# EAGLE design toshiba_board (EAGLE 7.1.0)
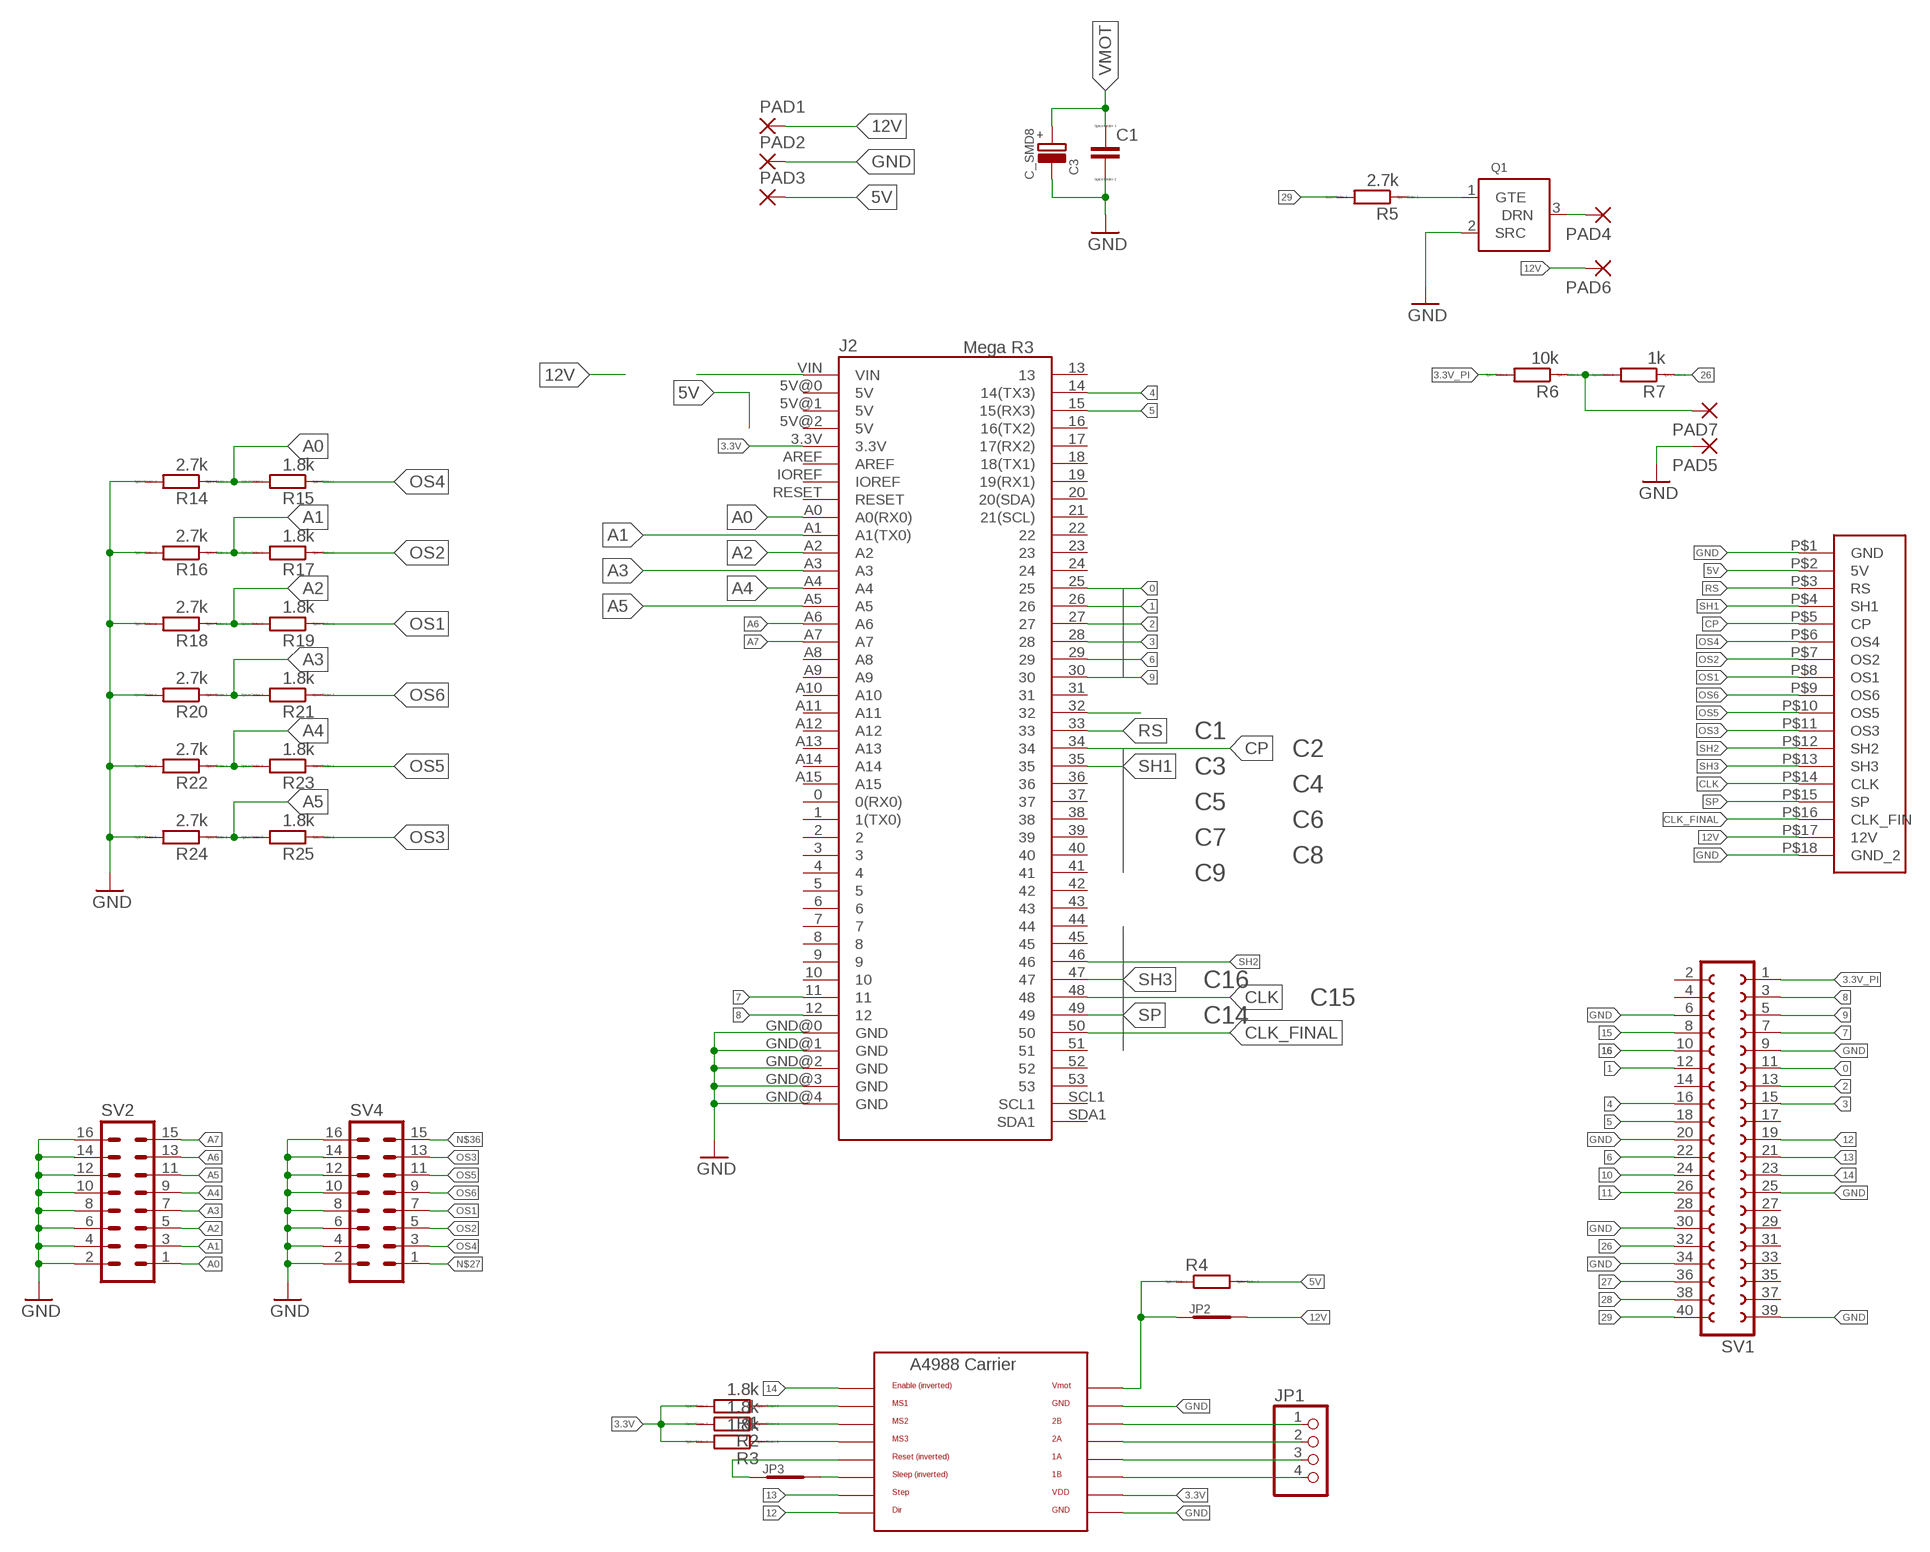
[diagram p0: schematic, sheet 1]

## Parts
C1  C-EUC0805  [C0805]
C3  C_SMD8  [C-SMD-8MM]
J2  Mega R3  ARDUINO-MEGAFULL  [ARDUINO_MEGA]
JP1  PINHD-1X4  [1X04]
JP2  SHORT0805  [0805_SHORT]
JP3  SHORT0805  [0805_SHORT]
PAD1  SMD2  [SMD1,27-2,54]
PAD2  SMD2  [SMD1,27-2,54]
PAD3  SMD2  [SMD1,27-2,54]
PAD4  SMD2  [SMD1,27-2,54]
PAD5  SMD2  [SMD1,27-2,54]
PAD6  SMD2  [SMD1,27-2,54]
PAD7  SMD2  [SMD1,27-2,54]
Q1  BSS138  [SOT23]
R1  1.8k  R-EU_R0603  [R0603]
R2  1.8k  R-EU_R0603  [R0603]
R3  1.8k  R-EU_R0603  [R0603]
R4  R-EU_R0805  [R0805]
R5  2.7k  R-EU_R0603  [R0603]
R6  10k  R-EU_R0603  [R0603]
R7  1k  R-EU_R0603  [R0603]
R14  2.7k  R-EU_R0603  [R0603]
R15  1.8k  R-EU_R0603  [R0603]
R16  2.7k  R-EU_R0603  [R0603]
R17  1.8k  R-EU_R0603  [R0603]
R18  2.7k  R-EU_R0603  [R0603]
R19  1.8k  R-EU_R0603  [R0603]
R20  2.7k  R-EU_R0603  [R0603]
R21  1.8k  R-EU_R0603  [R0603]
R22  2.7k  R-EU_R0603  [R0603]
R23  1.8k  R-EU_R0603  [R0603]
R24  2.7k  R-EU_R0603  [R0603]
R25  1.8k  R-EU_R0603  [R0603]
SV1  FE20-2  [FE20-2]
SV2  MA08-2  [MA08-2]
SV4  MA08-2  [MA08-2]
U$1  PIN_18  [PAD_18]
U$2  POLOLU_A4983CARRIER  [A4988BREAKOUT]

## Nets
0: J2.25 SV1.11
1: J2.26 SV1.12
2: J2.27 SV1.13
3: J2.28 SV1.15
3.3V: J2.3.3V R1.2 R2.2 R3.2 U$2.VDD
3.3V_PI: R6.2 SV1.1
4: J2.14(14(TX3)) SV1.16
5: J2.15(15(RX3)) SV1.18
5V: PAD3.1(P) R4.2 U$1.P$2(5V)
6: J2.29 SV1.22
7: J2.11 SV1.7
8: J2.12 SV1.3
9: J2.30 SV1.5
10: SV1.24
11: SV1.26
12: SV1.19 U$2.DIR
12V: JP2.P$2 PAD1.1(P) PAD6.1(P) U$1.P$17(12V)
13: SV1.21 U$2.STEP
14: SV1.23 U$2.EN
15: SV1.8
16: SV1.10
26: R7.1 SV1.32
27: SV1.36
28: SV1.38
29: R5.2 SV1.40
A0: J2.A0(A0(RX0)) R14.1 R15.2 SV2.1
A1: J2.A1(A1(TX0)) R16.1 R17.2 SV2.3
A2: J2.A2 R18.1 R19.2 SV2.5
A3: J2.A3 R20.1 R21.2 SV2.7
A4: J2.A4 R22.1 R23.2 SV2.9
A5: J2.A5 R24.1 R25.2 SV2.11
A6: J2.A6 SV2.13
A7: J2.A7 SV2.15
CLK: J2.48 U$1.P$14(CLK)
CLK_FINAL: J2.50 U$1.P$16(CLK_FIN)
CP: J2.34 U$1.P$5(CP)
GND: C1.2 C3.- J2.GND@0(GND) J2.GND@1(GND) J2.GND@2(GND) J2.GND@3(GND) J2.GND@4(GND) PAD2.1(P) PAD5.1(P) Q1.2(SRC) R14.2 R16.2 R18.2 R20.2 R22.2 R24.2 SV1.6 SV1.9 SV1.20 SV1.25 SV1.30 SV1.34 SV1.39 SV2.2 SV2.4 SV2.6 SV2.8 SV2.10 SV2.12 SV2.14 SV2.16 SV4.2 SV4.4 SV4.6 SV4.8 SV4.10 SV4.12 SV4.14 SV4.16 U$1.P$1(GND) U$1.P$18(GND_2) U$2.GND U$2.GND@0(GND)
N$2: Q1.1(GTE) R5.1
N$3: JP1.1 U$2.2B
N$4: JP1.2 U$2.2A
N$5: JP1.3 U$2.1A
N$6: PAD7.1(P) R6.1 R7.2
N$7: PAD4.1(P) Q1.3(DRN)
N$8: J2.VIN
N$13: JP1.4 U$2.1B
N$14: R1.1 U$2.MS1
N$15: R2.1 U$2.MS2
N$16: JP3.P$2 U$2.SLP(SLEEP)
N$17: R3.1 U$2.MS3
N$18: J2.32
N$19: JP3.P$1 U$2.RST
N$27: SV4.1
N$36: SV4.15
OS1: R19.1 SV4.7 U$1.P$8(OS1)
OS2: R17.1 SV4.5 U$1.P$7(OS2)
OS3: R25.1 SV4.13 U$1.P$11(OS3)
OS4: R15.1 SV4.3 U$1.P$6(OS4)
OS5: R23.1 SV4.11 U$1.P$10(OS5)
OS6: R21.1 SV4.9 U$1.P$9(OS6)
RS: J2.33 U$1.P$3(RS)
SH1: J2.35 U$1.P$4(SH1)
SH2: J2.46 U$1.P$12(SH2)
SH3: J2.47 U$1.P$13(SH3)
SP: J2.49 U$1.P$15(SP)
VMOT: C1.1 C3.+ JP2.P$1 R4.1 U$2.VMOT
Unconnected: J2.0(0(RX0)) J2.1(1(TX0)) J2.2 J2.3 J2.4 J2.5 J2.5V@0(5V) J2.5V@1(5V) J2.5V@2(5V) J2.6 J2.7 J2.8 J2.9 J2.10 J2.13 J2.16(16(TX2)) J2.17(17(RX2)) J2.18(18(TX1)) J2.19(19(RX1)) J2.20(20(SDA)) J2.21(21(SCL)) J2.22 J2.23 J2.24 J2.31 J2.36 J2.37 J2.38 J2.39 J2.40 J2.41 J2.42 J2.43 J2.44 J2.45 J2.51 J2.52 J2.53 J2.A8 J2.A9 J2.A10 J2.A11 J2.A12 J2.A13 J2.A14 J2.A15 J2.AREF J2.IOREF J2.RESET J2.SCL1 J2.SDA1 SV1.2 SV1.4 SV1.14 SV1.17 SV1.27 SV1.28 SV1.29 SV1.31 SV1.33 SV1.35 SV1.37

## Notes on the sheet
- C1
- C2
- C3
- C4
- C5
- C6
- C7
- C8
- C9
- C16
- C15
- C14

## Library data of the parts
C1 = resistor:C-EU: CAPACITOR, European symbol; SPICEPREFIX: C
C3 = diverses:C_SMD
J2 = zortness:ARDUINO-MEGA: Arduino MegaR3 board footprint. Also works for Due.
JP1 = RepRapjr:PINHD-1X4: PIN HEADER
JP2 JP3 = Diverse:SHORT
PAD1-PAD7 = wirepad:SMD2: SMD PAD
Q1 = zortness:BSS138
R1-R7 R14-R25 = resistor:R-EU_: RESISTOR, European symbol; SPICEPREFIX: R
SV1 = con-lsta:FE20-2: FEMALE HEADER; OC_FARNELL: unknown; OC_NEWARK: unknown
SV2 SV4 = con-lstb:MA08-2: PIN HEADER; OC_FARNELL: unknown; OC_NEWARK: unknown
U$1 = Diverse:PIN_18
U$2 = RepRapjr:POLOLU_A4983CARRIER

## Net classes
1 pwr: width 0.305 mm
2 raw: width 0.305 mm

## Board
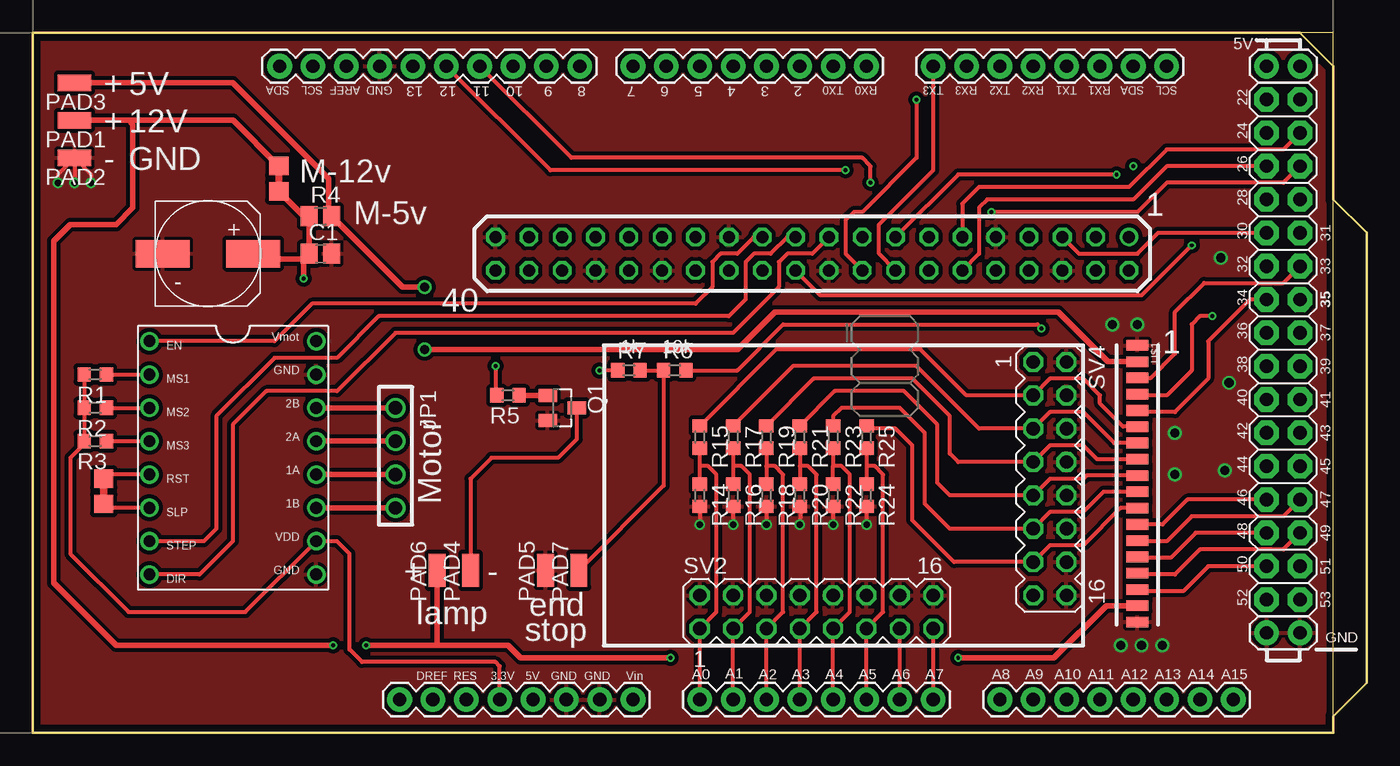
[diagram p1: board, top side]
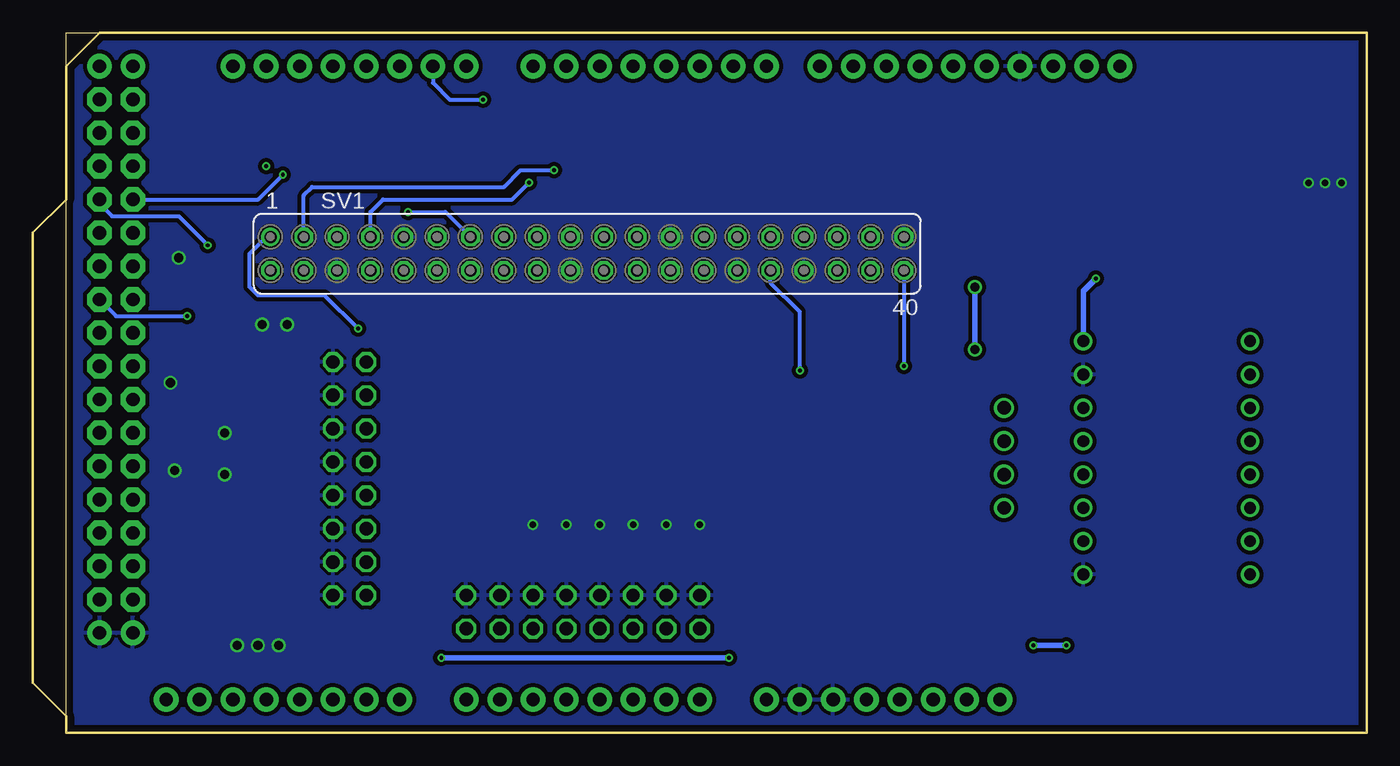
[diagram p2: board, bottom side, seen from below]

Size 99.04 x 53.33 mm. Coordinates in mm from the lower left corner, seen from the top.
Outline: 0,0 99.04,0 99.04,53.33 0,53.33 0,0
Copper layers (1*16): Top 0.035mm / dielectric 1.5mm / Bottom 0.035mm
Design rules "ShenZhen2U EagleRules": minimum track width 7mil, minimum drill 12mil, track to track 7mil, track to pad 7mil, pad to pad 7mil, via to via 7mil, smd to smd 0mil, copper to edge 20mil, drill to drill 10mil, minimum pad ring 10mil, minimum via ring 6mil, stop-mask expansion 2mil, vias tented up to drill 25mil, thermal gap 10mil

### Footprints (pad centres in the part's own frame; a part is rotated, then mirrored left to right if it is on the bottom)
C0805 = smd 1.3 x 1.5: 1 -0.85,0; 2 0.85,0
C-SMD-8MM = smd 4.1 x 2.1: + -3.45,0; - 3.45,0
ARDUINO_MEGA = drill 1.016 pad 1.88: 0 63.5,50.8; 1 60.96,50.8; 2 58.42,50.8; 3 55.88,50.8; 3.3V 35.56,2.54; 4 53.34,50.8; 5 50.8,50.8; 5V@0 38.1,2.54; 5V@1 93.98,50.8; 5V@2 96.52,50.8; 6 48.26,50.8; 7 45.72,50.8; 8 41.656,50.8; 9 39.116,50.8; 10 36.576,50.8; 11 34.036,50.8; 12 31.496,50.8; 13 28.956,50.8; 14 68.58,50.8; 15 71.12,50.8; 16 73.66,50.8; 17 76.2,50.8; 18 78.74,50.8; 19 81.28,50.8; 20 83.82,50.8; 21 86.36,50.8; A0 50.8,2.54; A1 53.34,2.54; A2 55.88,2.54; A3 58.42,2.54; A4 60.96,2.54; A5 63.5,2.54; A6 66.04,2.54; A7 68.58,2.54; A8 73.66,2.54; A9 76.2,2.54; A10 78.74,2.54; A11 81.28,2.54; A12 83.82,2.54; A13 86.36,2.54; A14 88.9,2.54; A15 91.44,2.54; AREF 23.876,50.8; EMPTY 27.94,2.54; GND@0 40.64,2.54; GND@1 43.18,2.54; GND@2 93.98,7.62; GND@3 96.52,7.62; GND@4 26.416,50.8; IOREF 30.48,2.54; RESET 33.02,2.54; SCL1 21.336,50.8; SDA1 18.796,50.8; VIN 45.72,2.54 | drill 1.016 pad 1.88 octagon: 22 93.98,48.26; 23 96.52,48.26; 24 93.98,45.72; 25 96.52,45.72; 26 93.98,43.18; 27 96.52,43.18; 28 93.98,40.64; 29 96.52,40.64; 30 93.98,38.1; 31 96.52,38.1; 32 93.98,35.56; 33 96.52,35.56; 34 93.98,33.02; 35 96.52,33.02; 36 93.98,30.48; 37 96.52,30.48; 38 93.98,27.94; 39 96.52,27.94; 40 93.98,25.4; 41 96.52,25.4; 42 93.98,22.86; 43 96.52,22.86; 44 93.98,20.32; 45 96.52,20.32; 46 93.98,17.78; 47 96.52,17.78; 48 93.98,15.24; 49 96.52,15.24; 50 93.98,12.7; 51 96.52,12.7; 52 93.98,10.16; 53 96.52,10.16
1X04 = drill 1.016: 1 -2.54,0; 2 0,0; 3 2.54,0; 4 5.08,0
0805_SHORT = smd 1.397 x 1.473: P$1 -0.965,0; P$2 0.965,0
SMD1,27-2,54 = smd 1.27 x 2.54: 1 0,0
SOT23 = smd 1 x 1.4: 1 -0.95,-1.1; 2 0.95,-1.1; 3 0,1.1
R0603 = smd 1 x 1.1: 1 -0.85,0; 2 0.85,0
R0805 = smd 1.3 x 1.5: 1 -0.85,0; 2 0.85,0
FE20-2 = drill 0.914: 1 -24.13,1.27 | drill 0.914 octagon: 2 -24.13,-1.27; 3 -21.59,1.27; 4 -21.59,-1.27; 5 -19.05,1.27; 6 -19.05,-1.27; 7 -16.51,1.27; 8 -16.51,-1.27; 9 -13.97,1.27; 10 -13.97,-1.27; 11 -11.43,1.27; 12 -11.43,-1.27; 13 -8.89,1.27; 14 -8.89,-1.27; 15 -6.35,1.27; 16 -6.35,-1.27; 17 -3.81,1.27; 18 -3.81,-1.27; 19 -1.27,1.27; 20 -1.27,-1.27; 21 1.27,1.27; 22 1.27,-1.27; 23 3.81,1.27; 24 3.81,-1.27; 25 6.35,1.27; 26 6.35,-1.27; 27 8.89,1.27; 28 8.89,-1.27; 29 11.43,1.27; 30 11.43,-1.27; 31 13.97,1.27; 32 13.97,-1.27; 33 16.51,1.27; 34 16.51,-1.27; 35 19.05,1.27; 36 19.05,-1.27; 37 21.59,1.27; 38 21.59,-1.27; 39 24.13,1.27; 40 24.13,-1.27
MA08-2 = drill 1.016 octagon: 1 -8.89,-1.27; 2 -8.89,1.27; 3 -6.35,-1.27; 4 -6.35,1.27; 5 -3.81,-1.27; 6 -3.81,1.27; 7 -1.27,-1.27; 8 -1.27,1.27; 9 1.27,-1.27; 10 1.27,1.27; 11 3.81,-1.27; 12 3.81,1.27; 13 6.35,-1.27; 14 6.35,1.27; 15 8.89,-1.27; 16 8.89,1.27
PAD_18 = smd 0.813 x 1.676: P$1 0,0; P$2 1.24,0; P$3 2.48,0; P$4 3.72,0; P$5 4.96,0; P$6 6.2,0; P$7 7.44,0; P$8 8.68,0; P$9 9.92,0; P$10 11.16,0; P$11 12.4,0; P$12 13.64,0; P$13 14.88,0; P$14 16.12,0; P$15 17.36,0; P$16 18.6,0; P$17 19.84,0; P$18 21.08,0
A4988BREAKOUT = drill 0.9: 1A 8.89,1.27; 1B 11.43,1.27; 2A 6.35,1.27; 2B 3.81,1.27; DIR 16.51,-11.43; EN -1.27,-11.43; GND 16.51,1.27; GND@0 1.27,1.27; MS1 1.27,-11.43; MS2 3.81,-11.43; MS3 6.35,-11.43; RST 8.89,-11.43; SLP 11.43,-11.43; STEP 13.97,-11.43; VDD 13.97,1.27; VMOT -1.27,1.27

### Placement (x,y rotation side)
C1  21.91,36.51 0 top
C3  13.34,36.51 180 top
J2  0,0 0 top
JP1  27.62,22.23 270 top
JP2  18.73,42.23 90 top
JP3  5.4,18.41 270 top
PAD1  3.17,46.67 90 top
PAD2  3.17,43.81 90 top
PAD3  3.17,49.53 90 top
PAD4  33.34,12.38 0 top
PAD5  39.05,12.38 0 top
PAD6  30.8,12.38 0 top
PAD7  41.59,12.38 0 top
Q1  40.32,24.77 270 top
R1  4.76,27.3 180 top
R2  4.76,24.77 180 top
R3  4.76,22.23 180 top
R4  21.91,39.37 0 top
R5  36.2,25.72 180 top
R6  48.9,27.62 0 top
R7  45.4,27.62 0 top
R14  50.8,18.1 270 top
R15  50.8,22.54 270 top
R16  53.34,18.1 270 top
R17  53.34,22.54 270 top
R18  55.88,18.1 270 top
R19  55.88,22.54 270 top
R20  58.42,18.1 270 top
R21  58.42,22.54 270 top
R22  60.96,18.1 270 top
R23  60.96,22.54 270 top
R24  63.5,18.1 270 top
R25  63.5,22.54 270 top
SV1  59.37,36.51 0 bottom
SV2  59.69,9.21 0 top
SV4  77.47,19.37 270 top
U$1  84.14,29.53 270 top
U$2  20.32,28.57 270 top

### Tracks (layer width: path | path; a pad name or v marks a point on that pad's centre or on a via)
0
  Top 0.305: J2.25 95.25,44.45 86.36,44.45 83.5,41.59 72.07,41.59 70.8,40.32 SV1.11
1
  Top 0.305: J2.26 86.36,43.18 83.82,40.64 72.71,40.64 72.07,40.01 72.07,36.51 SV1.12
2  (via drill 0.3)
  Top 0.305: J2.27 95.25,41.91 86.36,41.91 84.14,39.69 v73.03,39.69
  Bottom 0.305: v73.03,39.69 70.17,39.69 SV1.13
3  (via drill 0.3)
  Top 0.305: v82.55,42.55 70.48,42.55 SV1.15
  Bottom 0.305: J2.28 84.45,40.64 v82.55,42.55
3.3V
  Top 0.305: R1.2 R2.2 R3.2 3.91,22.01 2.86,20.95 2.86,13.65 7.3,9.21 16.19,9.21 U$2.VDD 23.18,14.61 24.13,13.65 24.13,6.35 25.08,5.4 35.24,5.4 35.56,5.08 J2.3.3V
3.3V_PI  (via drill 0.3)
  Top 0.305: R6.2 53.66,27.62 57.15,31.11 76.52,31.11 v76.83,30.8
  Bottom 0.305: v76.83,30.8 79.38,33.34 84.45,33.34 85.09,33.97 85.09,36.51 83.82,37.78 SV1.1
4
  Top 0.305: SV1.16 64.45,36.51 64.45,38.73 68.58,42.86 J2.14
5  (via drill 0.3)
  Top 0.305: v67.31,48.26 67.31,43.81 63.18,39.69 62.55,39.69 61.91,39.05 61.91,36.51 SV1.18
  Bottom 0.305: J2.15 71.12,49.53 69.85,48.26 v67.31,48.26
5V  (via drill 0.7)
  Top 0.406: U$1.P$2 81.89,28.29 78.11,32.07 56.52,32.07 53.66,29.21 v29.84,29.21 | PAD3.1 15.24,49.53 22.54,42.23 22.54,39.59 R4.2 28.16,33.97 v29.84,33.97
  Bottom 0.406: v29.84,29.21 v29.84,33.97
6  (via drill 0.3)
  Top 0.305: v88.27,37.15 84.45,33.34 60.01,33.34 SV1.22
  Bottom 0.305: J2.29 96.52,40.32 95.57,39.37 90.49,39.37 v88.27,37.15
7  (via drill 0.3)
  Top 0.305: v63.82,41.91 63.82,43.18 63.18,43.81 41.02,43.81 J2.11
  Bottom 0.305: SV1.7 75.88,39.69 74.93,40.64 65.09,40.64 v63.82,41.91
8  (via drill 0.3)
  Top 0.305: v61.91,42.86 39.43,42.86 J2.12
  Bottom 0.305: SV1.3 80.96,40.96 80.33,41.59 65.72,41.59 64.45,42.86 v61.91,42.86
9
  Top 0.305: SV1.5 79.69,36.51 84.14,36.51 85.72,38.1 J2.30
12
  Top 0.305: SV1.19 59.37,36.51 57.47,36.51 56.83,35.88 56.83,33.97 53.34,30.48 27.62,30.48 23.18,26.04 17.78,26.04 15.24,23.5 15.24,14.61 12.7,12.06 U$2.DIR
12V  (via drill 0.3)
  Top 0.406: PAD1.1 7.3,46.67 | 7.3,46.67 15.25,46.67 JP2.P$2 | U$1.P$17 81.76,9.69 77.79,5.71 v70.48,5.71 | v48.58,5.71 37.15,5.71 36.2,6.67 30.8,6.67 | 30.8,6.67 v25.4,6.67 | v22.86,6.67 6.35,6.67 1.59,11.43 1.59,37.47 2.86,38.73 6.35,38.73 7.62,40.01 7.62,46.35 7.3,46.67 | PAD6.1 30.8,6.67
  Bottom 0.406: v70.48,5.71 v48.58,5.71 | v25.4,6.67 v22.86,6.67
13
  Top 0.305: U$2.STEP 13.02,14.61 13.97,15.56 13.97,24.13 18.41,28.57 23.18,28.57 26.35,31.75 53.02,31.75 54.29,33.02 54.29,35.88 54.93,36.51 56.2,36.51 57.47,37.78 SV1.21
14
  Top 0.305: U$2.EN 18.41,29.84 21.27,32.7 50.48,32.7 51.75,33.97 51.75,35.88 52.39,36.51 53.66,36.51 54.93,37.78 SV1.23
26  (via drill 0.3)
  Top 0.305: R7.1 v43.18,27.62
  Bottom 0.305: v43.18,27.62 43.18,32.07 45.4,34.29 SV1.32
29  (via drill 0.3)
  Top 0.305: v35.24,27.94 35.24,25.82 R5.2
  Bottom 0.305: SV1.40 v35.24,27.94
A0
  Top 0.305: J2.A0 SV2.1 52.07,9.21 52.07,19.68 51.44,20.32 50.8,20.32 | R14.1 50.8,20.32 | 50.8,20.32 R15.2
A1
  Top 0.305: J2.A1 SV2.3 54.61,9.21 54.61,19.68 53.98,20.32 53.34,20.32 | R17.2 53.34,20.32 | 53.34,20.32 R16.1
A2
  Top 0.305: J2.A2 SV2.5 57.15,9.21 57.15,19.68 56.52,20.32 55.88,20.32 | 55.88,20.32 R18.1 | R19.2 55.88,20.32
A3
  Top 0.305: J2.A3 SV2.7 59.69,9.21 59.69,19.68 59.05,20.32 58.42,20.32 | R21.2 58.32,21.69 58.1,21.91 58.42,21.91 58.42,20.32 | 58.42,20.32 R20.1
A4
  Top 0.305: J2.A4 SV2.9 62.23,9.21 62.23,19.68 61.59,20.32 60.96,20.32 | R23.2 60.96,20.32 | R22.1 60.96,20.32
A5
  Top 0.305: J2.A5 SV2.11 64.77,9.21 64.77,19.68 64.14,20.32 63.5,20.32 | 63.5,20.32 R24.1 | R25.2 63.5,20.32
A6
  Top 0.305: J2.A6 SV2.13
A7
  Top 0.305: J2.A7 SV2.15
CLK
  Top 0.305: J2.48 88.58,15.24 86.68,13.34 84.21,13.34 U$1.P$14
CLK_FINAL
  Top 0.305: J2.50 89.53,12.7 87.63,10.79 84.27,10.79 U$1.P$16
CP
  Top 0.305: J2.34 92.71,33.02 89.53,29.84 89.53,26.99 87,24.45 84.26,24.45 U$1.P$5
GND  (via drill 0.5, 0.7)
  Top 0.305: R16.2 v53.34,15.88 | R22.2 v60.96,15.88 | R14.2 v50.8,15.88 | R24.2 v63.5,15.88 | R18.2 v55.88,15.88 | v58.42,15.88 58.63,17.46 R20.2 | PAD2.1 v3.17,41.91 | PAD2.1 4.45,42.55 v4.45,41.91 | PAD2.1 1.91,42.55 v1.91,41.91
  other vias: 82.23,31.11 84.14,31.11 82.87,6.67 84.45,6.67 86.04,6.67 87,22.86 87,19.68 90.81,20 91.12,26.67 90.49,36.2
  pour Bottom (isolate 0.305): 0,53.34 99.06,53.34 99.06,0 0,0
  pour Top (isolate 0.305): 0,53.34 99.06,53.34 99.06,0 0,0
N$1  (via drill 0.3)
  other vias: 83.82,43.18
N$2
  Top 0.406: Q1.1 R5.1
N$3
  Top 0.406: U$2.2B JP1.1
N$4
  Top 0.406: U$2.2A JP1.2
N$5
  Top 0.406: U$2.1A JP1.3
N$6
  Top 0.305: R7.2 R6.1 48.05,18.84 PAD7.1
N$7
  Top 0.305: Q1.3 41.42,22.37 40.01,20.95 34.92,20.95 33.34,19.37 33.34,13.02 33.02,12.7 PAD4.1
N$13
  Top 0.406: U$2.1B JP1.4
N$14
  Top 0.305: R1.1 U$2.MS1
N$15
  Top 0.305: R2.1 U$2.MS2
N$16
  Top 0.305: U$2.SLP 5.7,17.14 JP3.P$2
N$17
  Top 0.305: R3.1 U$2.MS3
N$19
  Top 0.305: U$2.RST 5.7,19.68 JP3.P$1
OS1
  Top 0.305: U$1.P$8 81.07,20.85 80.01,21.91 77.47,21.91 SV4.7 70.48,20.64 69.85,21.27 69.85,24.13 66.99,26.99 59.48,26.99 R19.1
OS2
  Top 0.305: U$1.P$7 82.37,22.09 80.01,24.45 77.47,24.45 SV4.5 72.07,23.18 67.31,27.94 57.89,27.94 R17.1
OS3
  Top 0.305: U$1.P$11 82.85,17.13 80.01,14.29 77.47,14.29 SV4.13 70.17,13.02 66.99,16.19 66.99,21.91 65.72,23.18 63.72,23.18 R25.1
OS4
  Top 0.305: U$1.P$6 83.03,23.33 81.28,25.08 81.28,25.72 80.01,26.99 77.47,26.99 SV4.3 71.12,25.72 67.63,29.21 56.62,29.21 R15.1
OS5
  Top 0.305: U$1.P$10 81.55,18.37 80.01,16.83 77.47,16.83 SV4.11 69.85,15.56 67.94,17.46 67.94,22.86 66.04,24.77 61.59,24.77 60.96,24.13 R23.1
OS6
  Top 0.305: U$1.P$9 80.25,19.61 80.01,19.37 77.47,19.37 SV4.9 69.85,18.1 68.9,19.05 68.9,23.5 66.36,26.04 61.06,26.04 R21.1
RS
  Top 0.305: U$1.P$3 85.15,27.05 87,28.89 87,32.07 89.22,34.29 95.25,34.29 J2.33
SH1  (via drill 0.3)
  Top 0.305: v89.85,31.75 88.9,31.75 88.27,31.11 88.27,27.62 86.36,25.72 84.23,25.72 U$1.P$4
  Bottom 0.305: J2.35 95.25,31.75 v89.85,31.75
SH2
  Top 0.305: J2.46 87.95,17.78 86.04,15.88 84.15,15.88 U$1.P$12
SH3
  Top 0.305: J2.47 95.25,16.51 88.27,16.51 86.36,14.61 84.18,14.61 U$1.P$13
SP
  Top 0.305: J2.49 95.25,13.97 88.9,13.97 87,12.06 84.24,12.06 U$1.P$15
VMOT  (via drill 0.3)
  Top 0.406: v20.64,34.61 20.64,36.09 | 20.64,36.09 C1.1 R4.1 20.62,39.37 JP2.P$1 | 20.64,36.09 17.2,36.09 C3.+
  Bottom 0.406: U$2.VMOT 21.59,33.66 v20.64,34.61

### Text on the board
tPlace: + | 5V | + | 12V | - | GND | M-12v | M-5v | 1 | 40 | 1k | 10k | 1 | Motor | + | - | end | lamp | stop